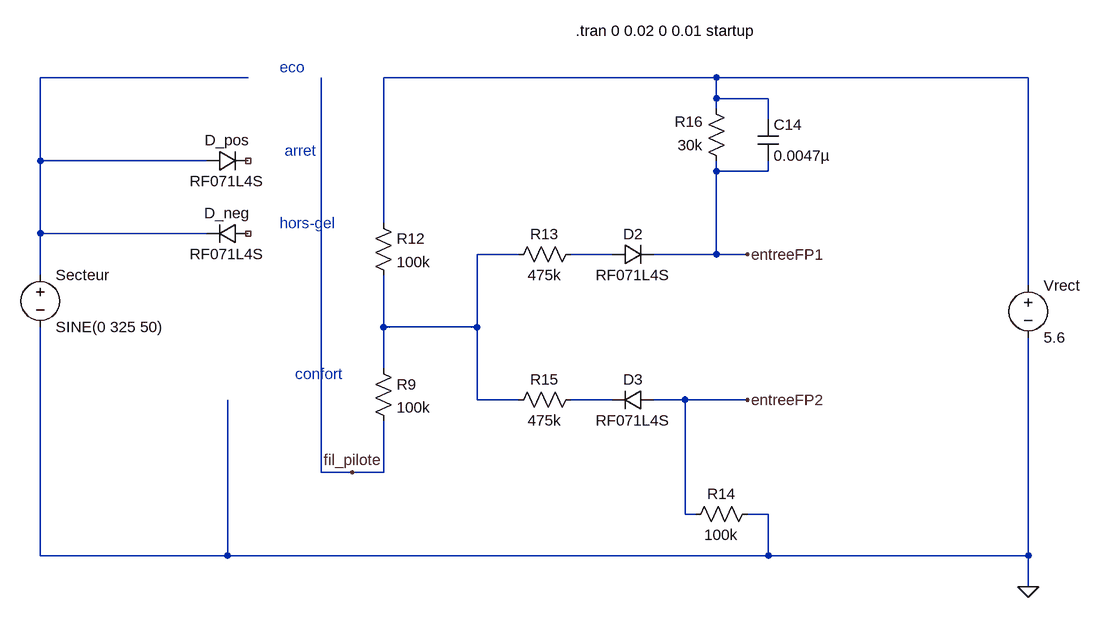
[diagram p0: schematic fil-pilote.asc]
fil-pilote.asc, the LTspice schematic file:
Version 4
SHEET 1 1200 680
WIRE -192 -144 -512 -144
WIRE 528 -144 16 -144
WIRE 1008 -144 528 -144
WIRE 528 -112 528 -144
WIRE 608 -112 528 -112
WIRE 528 -96 528 -112
WIRE 608 -80 608 -112
WIRE -512 -16 -512 -144
WIRE -256 -16 -512 -16
WIRE 528 0 528 -16
WIRE 608 0 608 -16
WIRE 608 0 528 0
WIRE 16 80 16 -144
WIRE -512 96 -512 -16
WIRE -256 96 -512 96
WIRE 224 128 160 128
WIRE 368 128 304 128
WIRE 528 128 528 0
WIRE 528 128 432 128
WIRE 576 128 528 128
WIRE -512 160 -512 96
WIRE 1008 176 1008 -144
WIRE 16 240 16 160
WIRE 160 240 160 128
WIRE 160 240 16 240
WIRE 16 304 16 240
WIRE 160 352 160 240
WIRE 224 352 160 352
WIRE 368 352 304 352
WIRE 480 352 432 352
WIRE 576 352 480 352
WIRE -80 464 -80 -144
WIRE -32 464 -80 464
WIRE 16 464 16 384
WIRE 16 464 -32 464
WIRE 480 528 480 352
WIRE 496 528 480 528
WIRE 608 528 576 528
WIRE -512 592 -512 240
WIRE -224 592 -224 352
WIRE -224 592 -512 592
WIRE 608 592 608 528
WIRE 608 592 -224 592
WIRE 1008 592 1008 256
WIRE 1008 592 608 592
WIRE 1008 640 1008 592
FLAG 1008 640 0
FLAG 576 128 entreeFP1
FLAG 576 352 entreeFP2
FLAG -32 464 fil_pilote
SYMBOL res 0 64 R0
SYMATTR InstName R12
SYMATTR Value 100k
SYMATTR SpiceLine tol=1
SYMBOL res 0 288 R0
SYMATTR InstName R9
SYMATTR Value 100k
SYMATTR SpiceLine tol=1
SYMBOL res 320 112 R90
WINDOW 0 0 56 VBottom 2
WINDOW 3 32 56 VTop 2
SYMATTR InstName R13
SYMATTR Value 475k
SYMATTR SpiceLine tol=1
SYMBOL res 320 336 R90
WINDOW 0 0 56 VBottom 2
WINDOW 3 32 56 VTop 2
SYMATTR InstName R15
SYMATTR Value 475k
SYMATTR SpiceLine tol=1
SYMBOL res 592 512 R90
WINDOW 0 0 56 VBottom 2
WINDOW 3 32 56 VTop 2
SYMATTR InstName R14
SYMATTR Value 100k
SYMATTR SpiceLine tol=1
SYMBOL res 544 0 R180
WINDOW 0 36 76 Left 2
WINDOW 3 36 40 Left 2
SYMATTR InstName R16
SYMATTR Value 30k
SYMATTR SpiceLine tol=1
SYMBOL cap 592 -80 R0
SYMATTR InstName C14
SYMATTR Value 0.0047µ
SYMATTR SpiceLine V=630 Irms=261m Rser=0.9428 Lser=0 mfg="KEMET" pn="C0805C472KBRAC" type="X7R"
SYMBOL diode 368 144 R270
WINDOW 0 32 32 VTop 2
WINDOW 3 0 32 VBottom 2
SYMATTR InstName D2
SYMATTR Value RF071L4S
SYMBOL diode 432 336 R90
WINDOW 0 0 32 VBottom 2
WINDOW 3 32 32 VTop 2
SYMATTR InstName D3
SYMATTR Value RF071L4S
SYMBOL voltage 1008 160 R0
WINDOW 123 0 0 Left 0
WINDOW 39 0 0 Left 0
SYMATTR InstName Vrect
SYMATTR Value 5.6
SYMBOL voltage -512 144 R0
WINDOW 123 0 0 Left 0
WINDOW 39 0 0 Left 0
SYMATTR InstName Secteur
SYMATTR Value SINE(0 325 50)
SYMBOL diode -256 0 R270
WINDOW 0 32 32 VTop 2
WINDOW 3 0 32 VBottom 2
SYMATTR InstName D_pos
SYMATTR Value RF071L4S
SYMBOL diode -192 80 R90
WINDOW 0 0 32 VBottom 2
WINDOW 3 32 32 VTop 2
SYMATTR InstName D_neg
SYMATTR Value RF071L4S
TEXT -144 -160 Left 2 ;eco
TEXT -120 312 Left 2 ;confort
TEXT -144 80 Left 2 ;hors-gel
TEXT -136 -32 Left 2 ;arret
TEXT 312 -216 Left 2 !.tran 0 0.02 0 0.01 startup

The netlist it stands for:
* fil-pilote.asc
R12 N002 N003 100k tol=1
R9 N003 fil_pilote 100k tol=1
R13 N004 N003 475k tol=1
R15 N005 N003 475k tol=1
R14 0 entreeFP2 100k tol=1
R16 entreeFP1 N002 30k tol=1
C14 N002 entreeFP1 0.0047µ V=630 Irms=261m Rser=0.9428 Lser=0 mfg="KEMET" pn="C0805C472KBRAC" type="X7R"
D2 N004 entreeFP1 RF071L4S
D3 entreeFP2 N005 RF071L4S
Vrect N002 0 5.6
V§Secteur N001 0 SINE(0 325 50)
D_pos N001 NC_01 RF071L4S
D_neg NC_02 N001 RF071L4S
.model D D
.lib standard.dio
* eco
* confort
* hors-gel
* arret
.tran 0 0.02 0 0.01 startup
.backanno
.end